# EAGLE design Automatic Battery Charger (EAGLE 6.4)
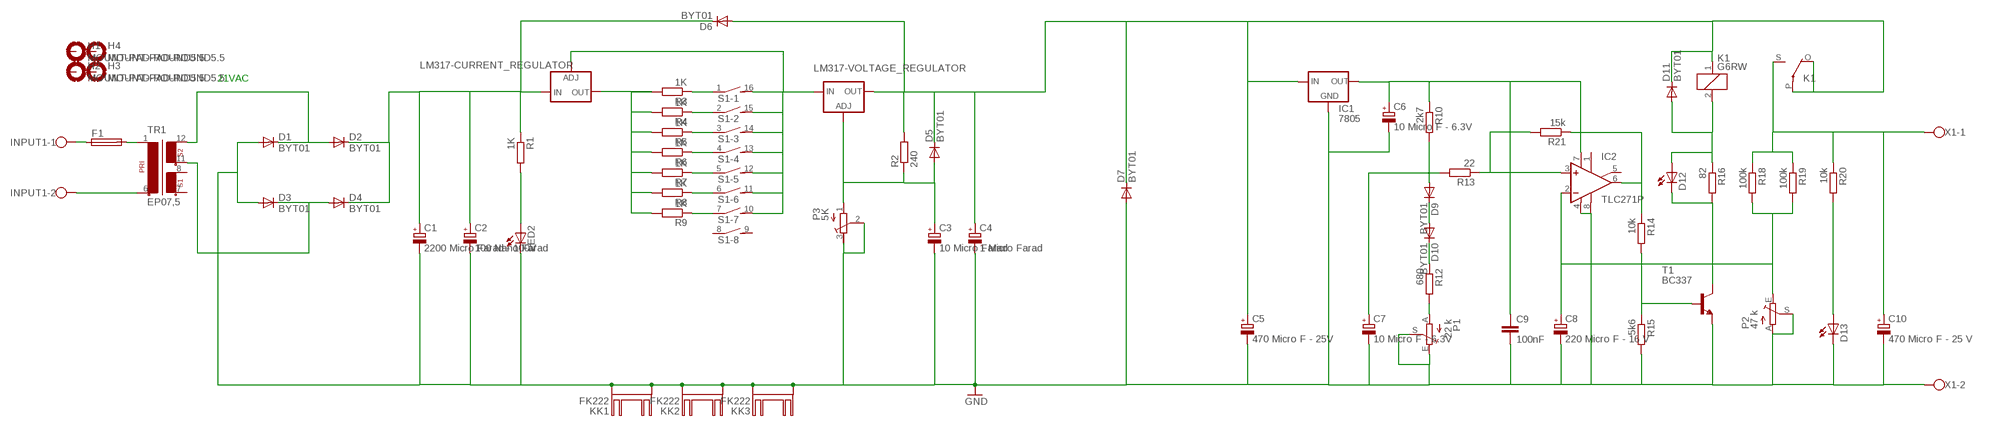
[diagram p0: schematic, sheet 1]

## Parts
C1  2200 Micro Farad - 100V  CPOL-EUE10-35  [EB35D]
C2  100 Nano Farad  CPOL-EUE1.8-4  [E1,8-4]
C3  10 Micro Farad  CPOL-EUE2-5  [E2-5]
C4  1 Micro Farad  CPOL-EUE2-5  [E2-5]
C5  470 Micro F - 25V  CPOL-EUE3.5-10  [E3,5-10]
C6  10 Micro F - 6.3V  CPOL-EUE2-5  [E2-5]
C7  10 Micro F - 6.3V  CPOL-EUE2-5  [E2-5]
C8  220 Micro F - 16 V  CPOL-EUE2.5-7  [E2,5-7]
C9  100nF  C-EU025-030X050  [C025-030X050]
C10  470 Micro F - 25 V  CPOL-EUE3.5-10  [E3,5-10]
D1  BYT01  [F126-10]
D2  BYT01  [F126-10]
D3  BYT01  [F126-10]
D4  BYT01  [F126-10]
D5  BYT01  [F126-10]
D6  BYT01  [F126-10]
D7  BYT01  [F126-10]
D9  BYT01  [F126-10]
D10  BYT01  [F126-10]
D11  BYT01  [F126-10]
D12  LED5MM  [LED5MM]
D13  LED5MM  [LED5MM]
F1  SH22,5A  [SH22,5A]
H1  MOUNT-PAD-ROUND5.5  [5,5-PAD]
H2  MOUNT-PAD-ROUND5.5  [5,5-PAD]
H3  MOUNT-PAD-ROUND5.5  [5,5-PAD]
H4  MOUNT-PAD-ROUND5.5  [5,5-PAD]
IC1  7805  78XXS  [78XXS]
IC2  TLC271P  [DIL08]
INPUT1  W237-102  [W237-102]
K1  G6RW  [G6RW]
KK1  FK222  [FK222]
KK2  FK222  [FK222]
KK3  FK222  [FK222]
LED2  LED5MM  [LED5MM]
LM317-CURRENT_REGULATOR  LM138-TS  [TO220S]
LM317-VOLTAGE_REGULATOR  LM138-TS  [TO220S]
P1  22 k  TRIM_EU-LI10  [LI10]
P2  47 k  TRIM_EU-LI10  [LI10]
P3  5K  R-TRIMM64X  [RTRIM64X]
R1  1K  R-EU_0207/7  [0207/7]
R2  240  R-EU_0207/7  [0207/7]
R3  1K  R-EU_0207/7  [0207/7]
R4  1K  R-EU_0207/7  [0207/7]
R5  1K  R-EU_0207/7  [0207/7]
R6  1K  R-EU_0207/10  [0207/10]
R7  1K  R-EU_0207/10  [0207/10]
R8  1K  R-EU_0207/15  [0207/15]
R9  1K  R-EU_0207/15  [0207/15]
R10  2k7  R-EU_0207/7  [0207/7]
R12  680  R-EU_0207/7  [0207/7]
R13  22  R-EU_0207/7  [0207/7]
R14  10k  R-EU_0207/7  [0207/7]
R15  5k6  R-EU_0207/7  [0207/7]
R16  82  R-EU_0207/7  [0207/7]
R18  100k  R-EU_0207/7  [0207/7]
R19  100k  R-EU_0207/7  [0207/7]
R20  10k  R-EU_0207/7  [0207/7]
R21  15k  R-EU_0207/7  [0207/7]
S1  DIP08SB  [DIP08SB]
T1  BC337  [TO92]
TR1  EP07,5  [EP07,5]
X1  W237-102  [W237-102]

## Nets
GND: C1.- C2.- C3.- C4.- C5.- C6.- C7.- C8.- C9.2 C10.- D1.A D3.A D7.A D13.K(C) IC1.GND IC2.4(V-) IC2.8(OPT) KK1.A2,8(K) KK1.B2,8(K) KK2.A2,8(K) KK2.B2,8(K) KK3.A2,8(K) KK3.B2,8(K) LED2.K(C) P1.E P1.S P2.A P2.S P3.2(S) P3.3(A) R15.2 T1.1(E) X1.2
N$3: C3.+ D5.A LM317-VOLTAGE_REGULATOR.1(ADJ) P3.1(E) R2.1
N$4: D1.C D2.A TR1.12
N$5: D3.C D4.A TR1.11
N$6: R3.1 S1.1
N$7: R4.1 S1.2
N$8: R5.1 S1.3
N$9: INPUT1.2 TR1.6
N$10: LED2.A R1.2
N$11: R6.1 S1.4
N$13: F1.2 TR1.1
N$14: R7.1 S1.5
N$15: R8.1 S1.6
N$16: R9.1 S1.7
N$17: C4.+ C5.+ D5.C D6.A D7.C D11.C IC1.IN K1.1 K1.O(2:O) K1.P(2:P) LM317-VOLTAGE_REGULATOR.2(OUT) R2.2
N$18: LM317-CURRENT_REGULATOR.2(OUT) R3.2 R4.2 R5.2 R6.2 R7.2 R8.2 R9.2
N$19: F1.1 INPUT1.1
N$20: LM317-CURRENT_REGULATOR.1(ADJ) LM317-VOLTAGE_REGULATOR.3(IN) S1.10 S1.11 S1.12 S1.13 S1.14 S1.15 S1.16
N$21: C6.+ C9.1 IC1.OUT IC2.7(V+) R10.1
N$23: C7.+ D9.A R10.2 R13.2
N$24: D9.C D10.A
N$25: D10.C R12.1
N$26: P1.A R12.2
N$28: C1.+ C2.+ D2.C D4.C D6.C LM317-CURRENT_REGULATOR.3(IN) R1.1
N$29: IC2.3(+IN) R13.1 R21.2
N$30: IC2.6(OUT) R14.1 R21.1
N$31: R14.2 R15.1 T1.2(B)
N$32: D12.K(C) R16.2 T1.3(C)
N$33: D11.A D12.A K1.2 R16.1
N$34: C10.+ K1.S(2:S) R18.1 R19.1 R20.1 X1.1
N$35: C8.+ IC2.2(-IN) P2.E R18.2 R19.2
N$36: D13.A R20.2
Unconnected: H1.B5,5(MOUNT) H2.B5,5(MOUNT) H3.B5,5(MOUNT) H4.B5,5(MOUNT) IC2.1(ON1) IC2.5(ON2) S1.8 S1.9 TR1.7 TR1.8

## Notes on the sheet
- 21VAC

## Library data of the parts
C1-C8 C10 = rcl:CPOL-EU: POLARIZED CAPACITOR, European symbol
C9 = rcl:C-EU: CAPACITOR, European symbol
D1-D7 D9-D11 = diode:BYT01: DIODE ultra fast
D12 D13 LED2 = led:LED: LED OSRAM: - CHIPLED LG R971, LG N971, LY N971, LG Q971, LY Q971, LO R971, LY R971 LH N974, LH R974 LS Q976, LO Q976, LY Q976 LO Q996 - Hyper CHIPLED LW Q18S LB Q993, LB Q99A, LB R99A - SideLED LS A670, LO A670, LY A670, LG A670, LP A670 LB A673, LV A673, LT A673, LW A673 LH A674 LY A675 LS A676, LA A676, LO A676, LY A676, LW A676 LS A679, LY A679, LG A679 - Hyper Micro SIDELED® LS Y876, LA Y876, LO Y876, LY Y876 LT Y87S - SmartLED LW L88C, LW L88S LB L89C, LB L89S, LG L890 LS L89K, LO L89K, LY L89K LS L896, LA L896, LO L896, LY L896 - TOPLED LS T670, LO T670, LY T670, LG T670, LP T670 LSG T670, LSP T670, LSY T670, LOP T670, LYG T670 LG T671, LOG T671, LSG T671 LB T673, LV T673, LT T673, LW T673 LH T674 LS T676, LA T676, LO T676, LY T676, LB T676, LH T676, LSB T676, LW T676 LB T67C, LV T67C, LT T67C, LS T67K, LO T67K, LY T67K, LW E67C LS E67B, LA E67B, LO E67B, LY E67B, LB E67C, LV E67C, LT E67C LW T67C LS T679, LY T679, LG T679 LS T770, LO T770, LY T770, LG T770, LP T770 LB T773, LV T773, LT T773, LW T773 LH T774 LS E675, LA E675, LY E675, LS T675 LS T776, LA T776, LO T776, LY T776, LB T776 LHGB T686 LT T68C, LB T68C - Hyper Mini TOPLED® LB M676 - Mini TOPLED Santana® LG M470 LS M47K, LO M47K, LY M47K Source: http://www.osram.convergy.de LUXEON: - LUMILED® LXK2-PW12-R00, LXK2-PW12-S00, LXK2-PW14-U00, LXK2-PW14-V00 LXK2-PM12-R00, LXK2-PM12-S00, LXK2-PM14-U00 LXK2-PE12-Q00, LXK2-PE12-R00, LXK2-PE12-S00, LXK2-PE14-T00, LXK2-PE14-U00 LXK2-PB12-K00, LXK2-PB12-L00, LXK2-PB12-M00, LXK2-PB14-N00, LXK2-PB14-P00, LXK2-PB14-Q00 LXK2-PR12-L00, LXK2-PR12-M00, LXK2-PR14-Q00, LXK2-PR14-R00 LXK2-PD12-Q00, LXK2-PD12-R00, LXK2-PD12-S00 LXK2-PH12-R00, LXK2-PH12-S00 LXK2-PL12-P00, LXK2-PL12-Q00, LXK2-PL12-R00 Source: www.luxeon.com KINGBRIGHT: KA-3528ASYC Source: www.kingbright.com
F1 = fuse:SH22,5A: FUSE HOLDER grid 22,5mm, isolated cap OGN0031 8201, Schurter (Buerklin); MPN: 0031.7701.11; OC_FARNELL: unknown; OC_NEWARK: 04F1224
H1-H4 = holes:MOUNT-PAD-ROUND: MOUNTING PAD, round
IC1 = v-reg:78XXS: VOLTAGE REGULATOR
IC2 = linear:TLC271: OP AMP
INPUT1 X1 = con-wago-500:W237-102: WAGO SCREW CLAMP; MPN: 237-102; OC_FARNELL: unknown; OC_NEWARK: 70K9898
K1 = relay:G6RW: RELAY 1 x switch, Omron; OC_FARNELL: unknown; OC_NEWARK: unknown
KK1-KK3 = heatsink:FK222: HEATSINK manufacturer Fischer/distributor Buerklin
LM317-CURRENT_REGULATOR LM317-VOLTAGE_REGULATOR = v-reg:LM138-TS: VOLTAGE REGULATOR
P1 P2 = pot:TRIM_EU-: POTENTIOMETER
P3 = resistor:R-TRIMM: Trimm resistor
R1-R10 R12-R16 R18-R21 = rcl:R-EU_: RESISTOR, European symbol
S1 = switch-dil:DIP08SB: DIL/CODE SWITCH; OC_FARNELL: unknown; OC_NEWARK: unknown
T1 = transistor:BC337: NPN TRANSISTOR
TR1 = trafo:EP07,5: TRANSFORMER 1 primary winding, 2 secondary windings BLOCK

## Board
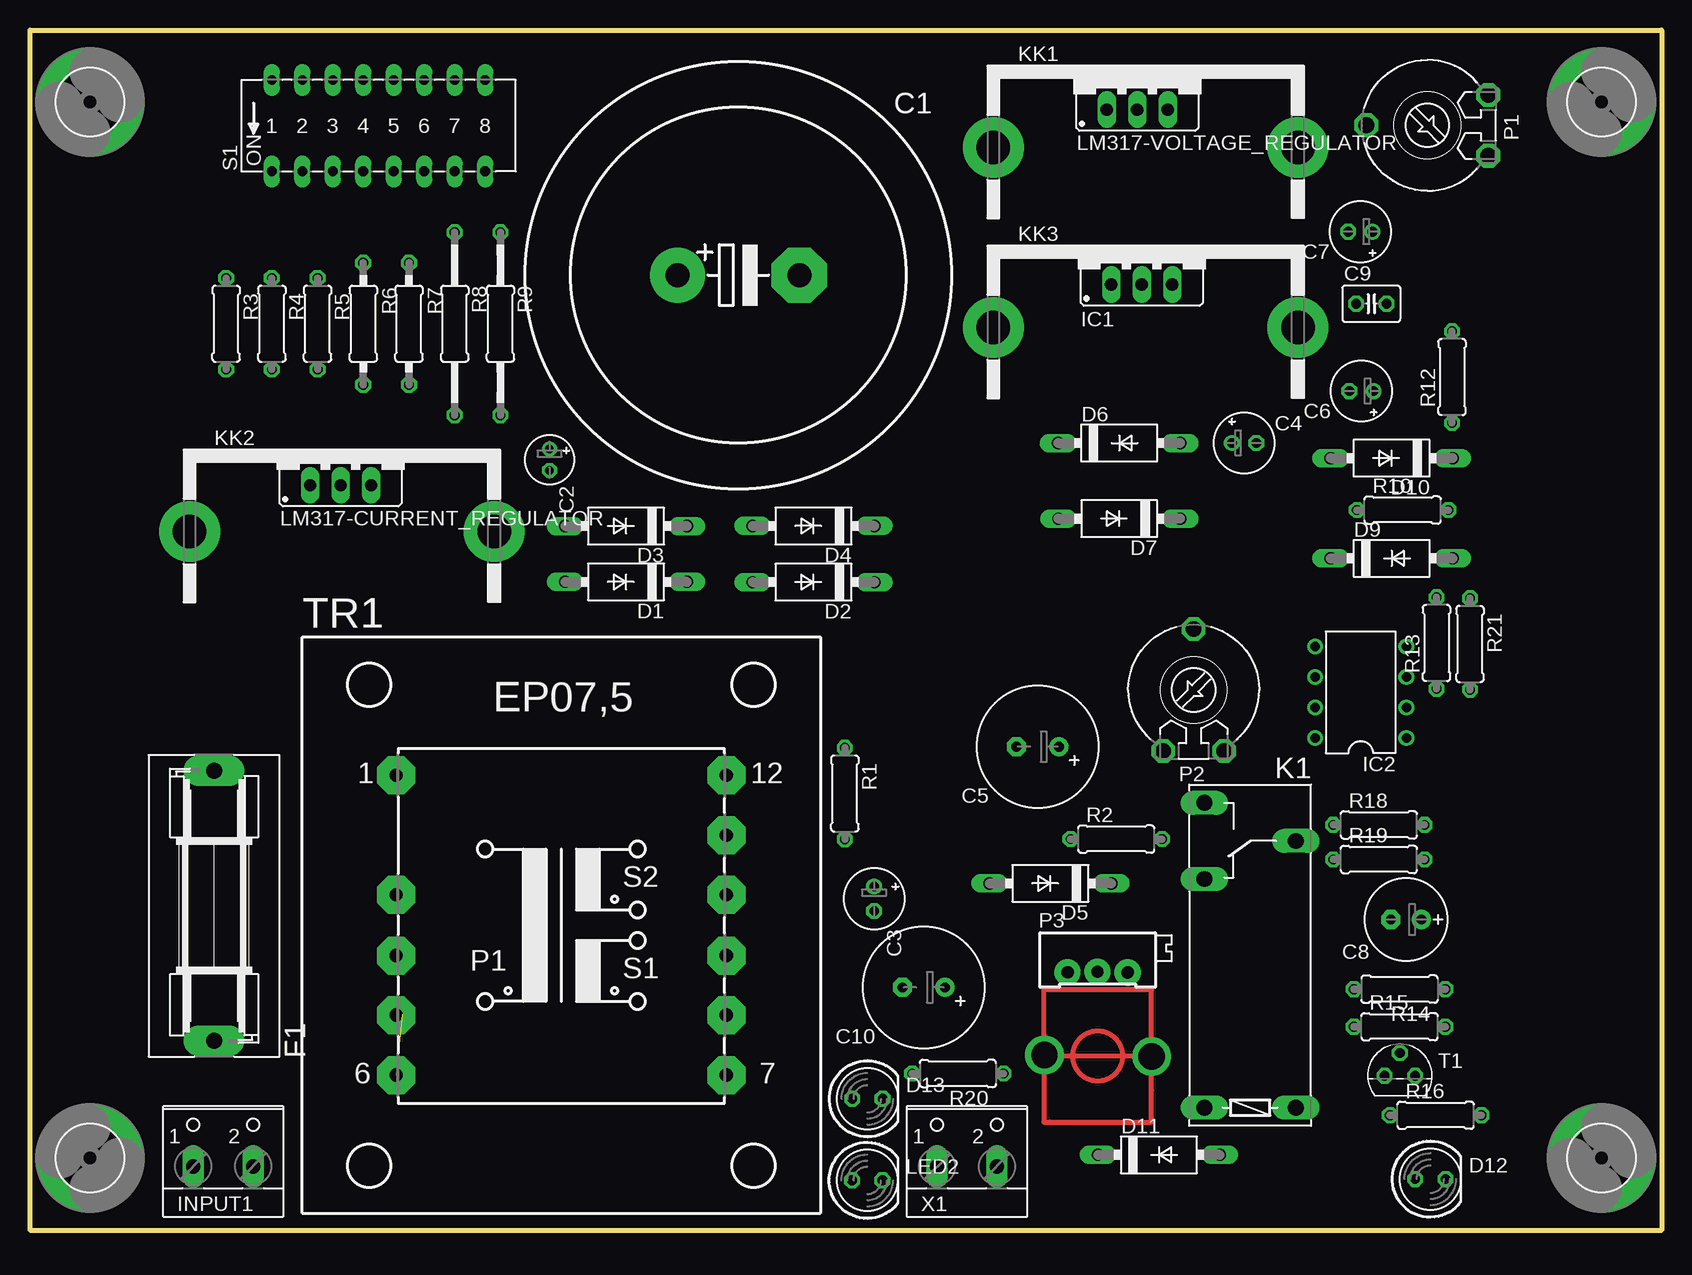
[diagram p1: board, top side]
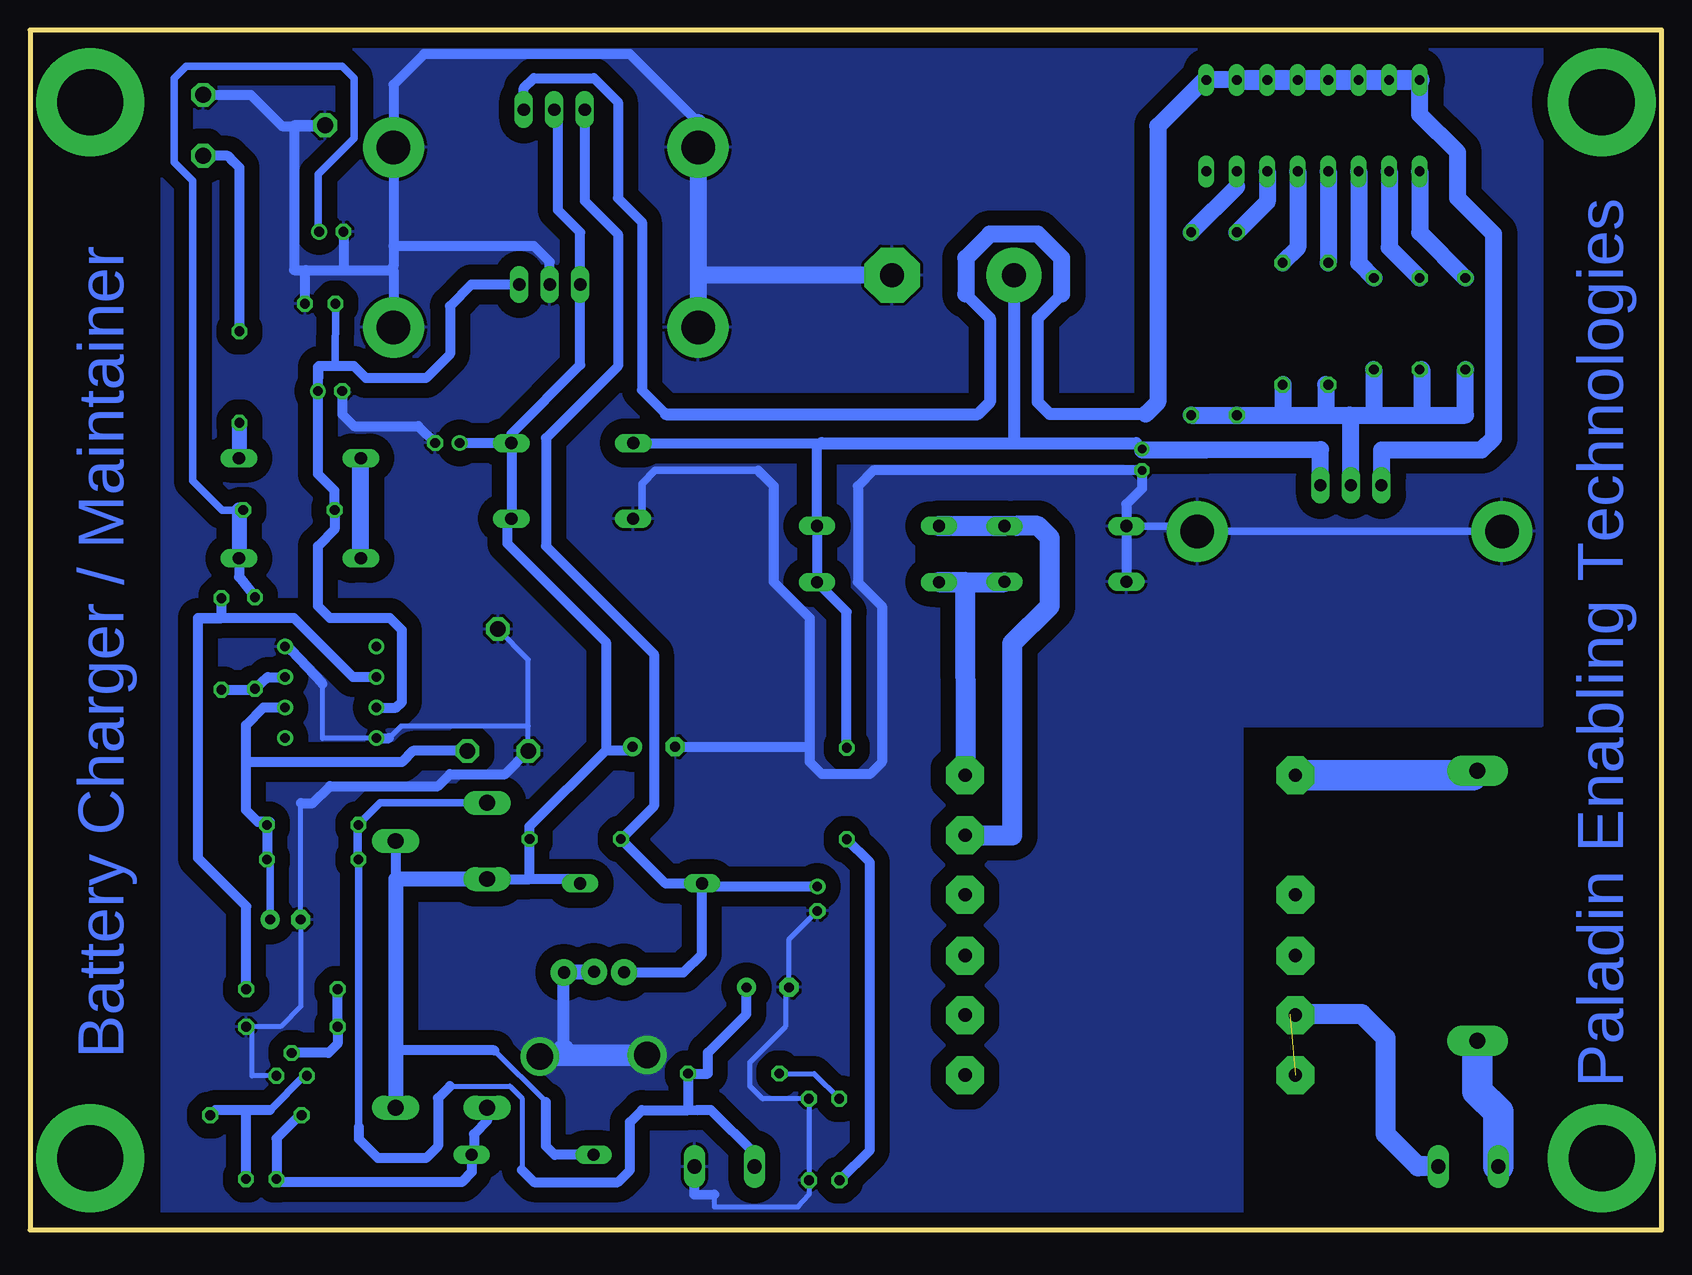
[diagram p2: board, bottom side, seen from below]

Size 136 x 100 mm. Coordinates in mm from the lower left corner, seen from the top.
Outline: 0,0 136,0 136,100 0,100 0,0
Copper layers (1*16): Top 0.035mm / dielectric 1.5mm / Bottom 0.035mm
Design rules "default": minimum track width 10mil, minimum drill 24mil, track to track 8mil, track to pad 8mil, pad to pad 8mil, via to via 8mil, smd to smd 8mil, copper to edge 40mil, drill to drill 8mil, minimum pad ring 10mil, minimum via ring 8mil, stop-mask expansion 4mil, vias tented up to drill 0mil, thermal gap 10mil

### Footprints (pad centres in the part's own frame; a part is rotated, then mirrored left to right if it is on the bottom)
EB35D = drill 2.007 pad 4.597: + -5.08,0 | drill 2.007 pad 4.597 octagon: - 5.08,0
E1,8-4 = drill 0.711 pad 1.168: + -0.889,0 | drill 0.711 pad 1.168 octagon: - 0.889,0
E2-5 = drill 0.813 pad 1.27: + -1.016,0 | drill 0.813 pad 1.27 octagon: - 1.016,0
E3,5-10 = drill 0.813 pad 1.6: + -1.778,0 | drill 0.813 pad 1.6 octagon: - 1.778,0
E2,5-7 = drill 0.813 pad 1.6: + -1.27,0 | drill 0.813 pad 1.6 octagon: - 1.27,0
C025-030X050 = drill 0.813 octagon: 1 -1.27,0; 2 1.27,0
F126-10 = drill 1.016 long: A 5.08,0; C -5.08,0
LED5MM = drill 0.813 octagon: A -1.27,0; K 1.27,0
SH22,5A = drill 1.321 pad 2.54 long: 1 -11.252,0; 2 11.252,0
5,5-PAD = drill 5.5 pad 9: B5,5 0,0
78XXS = drill 1.016 long: GND 0,-2.54; IN -2.54,-2.54; OUT 2.54,-2.54
DIL08 = drill 0.813 pad 1.27: 1 -3.81,-3.81; 2 -1.27,-3.81; 3 1.27,-3.81; 4 3.81,-3.81; 5 3.81,3.81; 6 1.27,3.81; 7 -1.27,3.81; 8 -3.81,3.81
W237-102 = drill 1.194 long: 1 -2.5,-1.27; 2 2.5,-1.27
G6RW = drill 1.321 long: 1 -12.7,-3.81; 2 -12.7,3.81; O 6.35,3.81; P 9.525,-3.81; S 12.7,3.81
FK222 = drill 2.794 pad 5.08: A2,8 5.791,-12.7; B2,8 5.791,12.7
TO220S = drill 1.016 long: 1 -2.54,-2.54; 2 0,-2.54; 3 2.54,-2.54
LI10 = drill 1.321 octagon: A -2.54,-5.08; E 2.54,-5.08; S 0,5.08
RTRIM64X = drill 0.61: 1 1.27,-2.54; 2 1.27,0; 3 1.27,2.54
0207/7 = drill 0.813 octagon: 1 -3.81,0; 2 3.81,0
0207/10 = drill 0.813 octagon: 1 -5.08,0; 2 5.08,0
0207/15 = drill 0.813 octagon: 1 -7.62,0; 2 7.62,0
DIP08SB = drill 0.813 long: 1 -8.89,-3.81; 2 -6.35,-3.81; 3 -3.81,-3.81; 4 -1.27,-3.81; 5 1.27,-3.81; 6 3.81,-3.81; 7 6.35,-3.81; 8 8.89,-3.81; 9 8.89,3.81; 10 6.35,3.81; 11 3.81,3.81; 12 1.27,3.81; 13 -1.27,3.81; 14 -3.81,3.81; 15 -6.35,3.81; 16 -8.89,3.81
TO92 = drill 0.813 octagon: 1 1.27,0; 2 0,1.905; 3 -1.27,0
EP07,5 = drill 1.118 pad 3.175 octagon: 1 -13.767,12.497; 3 -13.767,2.54; 4 -13.767,-2.54; 5 -13.767,-7.493; 6 -13.767,-12.497; 7 13.767,-12.497; 8 13.767,-7.493; 9 13.767,-2.54; 10 13.767,2.54; 11 13.767,7.493; 12 13.767,12.497

### Placement (x,y rotation side)
C1  59.05,79.57 0 top
C2  43.31,64.19 270 top
C3  70.37,27.6 270 top
C4  101.21,65.59 0 top
C5  84,40.27 180 top
C6  110.99,69.91 180 top
C7  110.89,83.19 180 top
C8  114.7,25.87 180 top
C9  111.81,77.19 0 top
C10  74.5,20.22 180 top
D1  49.69,54.01 180 top
D2  65.31,53.99 180 top
D3  49.69,58.66 180 top
D4  65.31,58.67 180 top
D5  85.06,28.88 180 top
D6  90.79,65.58 0 top
D7  90.8,59.28 180 top
D9  113.5,55.97 0 top
D10  113.5,64.32 180 top
D11  94.11,6.26 0 top
D12  116.73,4.24 0 top
D13  69.81,10.94 0 top
F1  15.35,27.02 90 top
H1  5,6 90 top
H2  5,94 0 top
H3  131,6 0 top
H4  131,94 0 top
IC1  92.67,81.33 0 top
IC2  110.93,44.81 90 top
INPUT1  16.1,6.57 0 top
K1  101.71,22.89 90 top
KK1  93,96 270 top
KK2  26,64 270 top
KK3  93,81 270 top
LED2  69.79,4.14 0 top
LM317-CURRENT_REGULATOR  25.89,64.61 0 top
LM317-VOLTAGE_REGULATOR  92.3,95.9 0 top
P1  116.48,92.05 90 top
P2  97,45 0 top
P3  89,22.75 270 top
R1  67.92,36.37 270 top
R2  90.55,32.58 0 top
R3  16.35,75.52 270 top
R4  20.16,75.52 270 top
R5  23.97,75.52 270 top
R6  27.78,75.52 270 top
R7  31.59,75.52 270 top
R8  35.4,75.52 270 top
R9  39.21,75.52 270 top
R10  114.42,60 0 top
R12  118.54,71.08 90 top
R13  117.24,48.91 90 top
R14  114.16,20.07 180 top
R15  114.16,16.94 0 top
R16  117.17,9.56 0 top
R18  112.44,33.76 0 top
R19  112.44,30.88 0 top
R20  77.34,13.04 180 top
R21  120.04,48.84 270 top
S1  29.05,92.03 0 top
T1  114.19,12.85 0 top
TR1  44.29,25.4 0 top
X1  78.11,6.56 0 top

### Tracks (layer width: path | path; a pad name or v marks a point on that pad's centre or on a via)
GND  (via drill 2.2)
  Bottom 0.406: 71.08,4.15 D13.K 74.94,10.94 76,12 76,14 73,17 73,19.94 C10.- 72.72,24.23 C3.- | 71.08,4.15 LED2.K | 71.08,4.15 71.08,2.92 71.97,1.94 78.96,1.93 78.96,2.94 | 80.59,5.28 X1.2 | 117.5,16.95 115.11,16.95 113.43,18.63 C8.- 113.43,35.57 | 117.5,16.95 R15.2 | T1.1 117.5,12.85 117.5,16.95 | IC2.8 111.58,41 111.62,40.95 111.62,45.5 | P3.2 | P2.S 94.46,47.54 P2.A 94.46,42 105.08,42 106.08,41
  Bottom 0.61: P3.2 88.98,21.48 | D3.A 39.15,58.66 KK2.B2,8 KK2.A2,8 | D7.A 85,59.28 85,62.19 83.89,63.3 75.3,63.3
  Bottom 0.813: D1.A D3.A 44.61,60.48 43.31,61.78 C2.- 65.7,63.3 67,62 67,54 65,52 65,39 66,38 70,38 71,39 71,40 | 111.62,45.5 114.24,48.31 114.56,48.62 IC2.4 | 78.96,2.94 80.61,2.98 X1.2 | 105.66,75.17 KK3.B2,8 105.7,80 106,80 | C9.2 113.08,79.92 113,80 | 110,80 106,80 | C7.- 109.87,80.13 110,80 | 113,80 114,80 114,92.05 P1.S 111.46,92 115,92 117.59,94.59 P1.E | 113,80 110,80 | C6.- 109.97,67.97 109,67 103.64,67 C4.- | KK1.A2,8 80.3,84 80.17,84.13 | 105.7,82 KK1.B2,8 105.7,95.45 103.16,98 86,98 80.3,92.3 | 105.7,82 105.7,80.3 106,80 | IC1.GND 92.67,80.67 94,82 105.7,82 | 71,40 71,51 74,54 74,62 75,63 75.11,63.1 75.25,63.24 75.3,63.3 | C5.- 71.27,40.27 71,40 | IC2.8 106.08,41 | 113.43,35.57 112.43,35.57 111,37 102,37 101,38 96.38,38 P2.A
  Bottom 1.016: 91.54,15.03 P3.3
  Bottom 1.27: P3.2 P3.3
  Bottom 1.422: C1.- 80.3,79.57 KK3.A2,8 KK1.A2,8 80.3,92.3
  Bottom 1.778: v84.56,14.57 92,14.57 | 92,14.57 93.38,14.57 v93.49,14.46 | 91.54,15.03 92,14.57
  pour Bottom (isolate 1.27): 35,0 125,0 125,100 10,100 10,42 35,42
N$1  (via drill 1 pad 2.18)
  other vias: 86.48,21.49
N$2  (via drill 1)
  other vias: 86.5,21.5
N$3
  Bottom 0.813: C3.+ 79.72,28.62 D5.A 80,28.86 | P3.1 81.52,21.48 80,23 80,28.86 | 80,28.86 83.02,28.86 R2.1 84,35.32 84,48 93,57 93,66 87,72 87,83 89.76,85.76 LM317-VOLTAGE_REGULATOR.1
N$4
  Bottom 0.813: TR1.12 58,37.9 | D2.A 58,53.99 58,54 | 54.77,53.99 D1.C
  Bottom 1.676: 54.77,53.99 D2.A 58.03,54.01 58,37.9
N$5
  Bottom 0.813: D3.C
  Bottom 1.676: D4.A D3.C | TR1.11 54.11,32.89 54.11,48.89 51,52 51,57.68 51.99,58.67 53.76,58.67 D3.C
N$6
  Bottom 1.422: S1.1 20.16,83.14 R3.1
N$7
  Bottom 1.422: S1.2 22.7,81.87 R4.1
N$8
  Bottom 1.422: S1.3 25.24,80.6 R5.1
N$9  (1 unrouted)
  Bottom 1.676: INPUT1.2 20.3,5.3 23,8 23,16 25,18 31,18
N$10
  Bottom 0.813: LED2.A 66,6.66 66,30.64 R1.2
N$11
  Bottom 1.422: S1.4 R6.1
N$12
  Top 0.406: 85,9 93.49,9 93.49,11.64 93.5,11.64 93.5,20.02 84.49,20.02 84.49,16.33 84.5,16.33 84.5,8.99 84.98,8.99
N$13
  Bottom 2.54: TR1.1 15.72,37.9 F1.2
N$14
  Bottom 1.422: S1.5 30.32,81.87 R7.1
N$15
  Bottom 1.422: S1.6 32.86,85.68 R8.1
N$16
  Bottom 0.813: S1.7 35.4,86.95
  Bottom 1.422: 35.4,86.95 R9.1
N$17
  Bottom 0.406: 93,10.68 97.3,14.98
  Bottom 0.61: K1.O 96.75,29.25
  Bottom 0.813: D6.A 95.87,59.29 D7.C 96.22,58.94 96.22,57.22 88,49 88,40 | 96.75,29.25 94.36,29.25 | D5.C 90.5,29.25 94.36,29.25 | K1.P 105.52,29 | 94.36,29.25 R2.2 94.36,33.64 88,40 | D6.A C4.+ | D6.A 95.87,66.34 90.13,72.09 IC1.IN 90.13,83.13 92,85 92,93.07 LM317-VOLTAGE_REGULATOR.2 | D11.C 92.26,6.26 93,7 93,10.68 | 97.3,14.98 105.5,14.98 105.52,15 | 88,40 86.05,40 C5.+
  Bottom 1.27: K1.O 105.52,29.25 105.52,29 105.52,15 K1.1
N$18
  Bottom 0.813: R4.2 20,71.71 | R5.2 24,71.71 | R6.2 28,70.44 | R7.2 31.55,70.44 | 25.89,67.79 26,67.9
  Bottom 1.422: R9.2 R8.2 31.55,67.9 | 31.55,67.9 28,67.9 | 28,67.9 26,67.9 24,67.9 | 24,67.9 20,67.9 | 20,67.9 16.35,67.9 R3.2 | 20,71.71 20,67.9 | 24,71.71 24,67.9 | 28,70.44 28,67.9 | 31.55,70.44 31.55,67.9 | LM317-CURRENT_REGULATOR.2 25.89,67.79
N$19
  Bottom 2.54: F1.1 15.35,11.58 13.62,9.85 13.62,5.32 INPUT1.1
N$20
  Bottom 0.813: LM317-VOLTAGE_REGULATOR.3 94.84,95.16 94,96 89,96 87,94 87,86 85,84 85,70 83,68
  Bottom 1.016: 43,68 51,68 52,69 52,76 50,78 | 58,78 56,76 56,69 57,68 83,68
  Bottom 1.422: LM317-CURRENT_REGULATOR.1 23.35,65.02 14.98,65.02 14,66 14,83 17,86 17,89.79 20.16,92.95 S1.16 | S1.10 37.84,95.84 38,96 42,92 42,69 43,68 | 50,78 50,81 52,83 56,83 58,81 58,78
  Bottom 1.676: S1.10 S1.11 S1.12 S1.13 S1.14 S1.15 S1.16
N$21
  Bottom 0.61: C6.+ 112.01,71.72 112,71.72 112,72 110.55,72 110.54,71.98 C9.1
  Bottom 0.813: 112,71.9 112,63 110.61,61.61 R10.1 110.61,58.39 112,57 112,52 111,51 106,51 105,50 105,44 105.46,43.54 IC2.7 | 112,71.9 C6.+ | IC1.OUT 99.21,78.79 101,77 101,73 103,71 108,71 109,72 111.9,72 112,71.9
N$23
  Bottom 0.406: R10.2 118.58,60
  Bottom 0.61: R10.2 120,60 122.42,62.42 122.42,87.42 124,89 124,96 123,97 110,97 109,96 109,91 112,88 112,83.29 C7.+
  Bottom 0.813: D9.A 118.58,54.43 R13.2
  Bottom 1.27: 118.58,60 D9.A
N$24
  Bottom 1.422: D9.C D10.A
N$25
  Bottom 0.406: D10.C 118.53,64.32
  Bottom 1.27: 118.53,64.32 R12.1
N$26
  Bottom 0.813: R12.2 118.54,88.54 119,89 119.01,89 119.52,89.51 P1.A
N$27  (via drill 1)
  other vias: 91.5,21.5
N$28
  Bottom 0.813: D2.C D4.C 70.39,65.19 70,65.58 D6.C | 43.23,65 C2.+ 43.81,65.58 | 70.41,53.98 D2.C | R1.1 67.92,51.52 D2.C | 53.97,65.61 54,65.58
  Bottom 1.016: 70,65.58 54,65.58 43.81,65.58 | C1.+ 53.97,65.61
  Bottom 1.422: LM317-CURRENT_REGULATOR.3 28.43,65.04 38,65 43.23,65
N$29
  Bottom 0.406: 117.32,45.02 R13.1
  Bottom 0.813: R21.2 117.32,45.02 | R13.1 116.18,46.08 IC2.3
N$30
  Bottom 0.813: R14.1 117.97,26.97 122,31 122,51 | 122,51 120.04,51 R21.1 | IC2.6 109.08,46.08 114,51 122,51
N$31
  Bottom 0.406: 110.36,16.95 R15.1 | R14.2
  Bottom 0.813: R15.1 R14.2 | 110.36,16.95 110.36,15.51 111.11,14.76 T1.2
N$32
  Bottom 0.406: T1.3 113.15,12.85 | 120.54,10 R16.2
  Bottom 0.61: 113.15,12.85 116,10
  Bottom 0.813: 116,10 118,10 | 118,10 120.54,10 | D12.K 118,10
N$33
  Bottom 0.813: R16.1 113.53,9.56 115.46,7.63 D12.A 115.22,4 100,4 99.19,4.81 D11.A 99,6.45 99,8 97.9,9.1 K1.2
N$34
  Bottom 0.406: X1.1 75.51,6.29 | 101,12 96,12 95,11 95,5
  Bottom 0.61: R19.1 R18.1 106.79,35.59 K1.S 106.81,35.59 108.71,33.69 108.71,31 108.6,30.89 108.6,8.6
  Bottom 0.813: 75.51,6.29 79.24,10 80.37,10 81.15,10.01 | 81.15,10.01 R20.1 79.48,13.04 79.48,14.79 76.28,18 C10.+ | 108.6,8.6 108.6,7.6 107,6 103,6 102,7 102,11 101,12 | 95,5 94,4 87,4 86,5 86,9 85,10 81.16,10 81.15,10.01
N$35
  Bottom 0.406: 116,34.01 R18.2
  Bottom 0.61: C8.+ 115.97,30.61 R19.2
  Bottom 0.813: R18.2 R19.2 | P2.E 104.08,39.92 105,39 118,39 | 116,34.01 117.01,34.01 118,35 118,39 | 118,39 118,42.08 116.53,43.55 IC2.2
N$36
  Bottom 0.406: R20.2 70.64,13.04 D13.A
N$37
  Top 0.406: 84.5,14.52 93.5,14.52
N$38  (via drill 1 pad 2.18)
  other vias: 88.99,21.52
N$39  (via drill 1 pad 2.18)
  other vias: 91.5,21.45
N$40
  cutout Bottom: 53,53 62,53 62,60 53,60
(copper drawn outside any net)
  shapes: Top circle x1

### Text on the board
Bottom: Paladin Enabling Technologies | Battery Charger / Maintainer